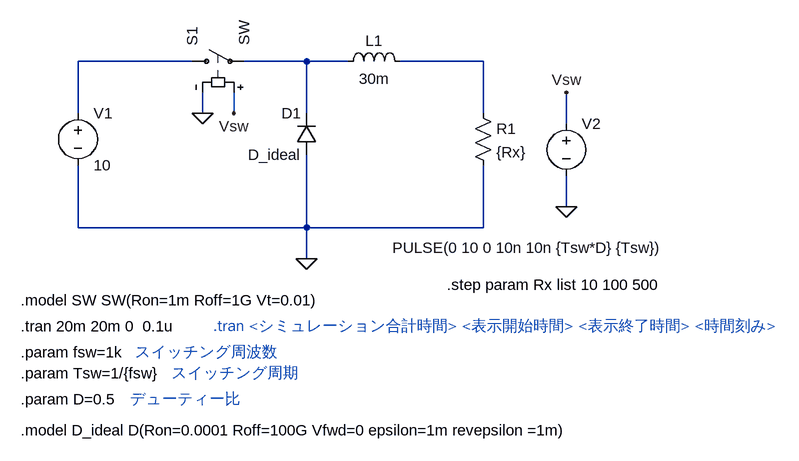
[diagram p0: schematic prof_03_back.asc]
prof_03_back.asc, the LTspice schematic file:
Version 4
SHEET 1 1108 680
WIRE 16 -16 -160 -16
WIRE 192 -16 96 -16
WIRE 256 -16 192 -16
WIRE 464 -16 336 -16
WIRE -160 64 -160 -16
WIRE 32 64 32 32
WIRE 80 64 80 32
WIRE 192 64 192 -16
WIRE 464 64 464 -16
WIRE 592 80 592 32
WIRE 592 208 592 160
WIRE -160 240 -160 144
WIRE 192 240 192 128
WIRE 192 240 -160 240
WIRE 464 240 464 144
WIRE 464 240 192 240
WIRE 192 288 192 240
FLAG 192 288 0
FLAG 592 208 0
FLAG 592 32 Vsw
FLAG 32 64 0
FLAG 80 64 Vsw
SYMBOL voltage -160 48 R0
SYMATTR InstName V1
SYMATTR Value 10
SYMBOL sw 0 -16 R270
SYMATTR InstName S1
SYMBOL ind 240 0 R270
WINDOW 0 32 56 VTop 2
WINDOW 3 5 56 VBottom 2
SYMATTR InstName L1
SYMATTR Value 30m
SYMBOL res 448 48 R0
SYMATTR InstName R1
SYMATTR Value {Rx}
SYMBOL diode 208 128 R180
WINDOW 0 24 64 Left 2
WINDOW 3 24 0 Left 2
SYMATTR InstName D1
SYMATTR Value D_ideal
SYMBOL voltage 592 64 R0
WINDOW 3 -268 207 Left 2
SYMATTR Value PULSE(0 10 0 10n 10n {Tsw*D} {Tsw})
SYMATTR InstName V2
TEXT -248 352 Left 2 !.model SW SW(Ron=1m Roff=1G Vt=0.01)
TEXT -248 392 Left 2 !.tran 20m 20m 0  0.1u
TEXT -248 432 Left 2 !.param fsw=1k
TEXT -248 464 Left 2 !.param Tsw=1/{fsw}
TEXT -248 504 Left 2 !.param D=0.5
TEXT -80 504 Left 2 ;デューティー比
TEXT -16 464 Left 2 ;スイッチング周期
TEXT -72 432 Left 2 ;スイッチング周波数
TEXT 48 392 Left 2 ;.tran <シミュレーション合計時間> <表示開始時間> <表示終了時間> <時間刻み>
TEXT -248 552 Left 2 !.model D_ideal D(Ron=0.0001 Roff=100G Vfwd=0 epsilon=1m revepsilon =1m)
TEXT 408 328 Left 2 !.step param Rx list 10 100 500

The netlist it stands for:
* prof_03_back.asc
V1 N001 0 10
S1 N001 N002 Vsw 0 SW
L1 N002 N003 30m
R1 N003 0 {Rx}
D1 0 N002 D_ideal
V2 Vsw 0 PULSE(0 10 0 10n 10n {Tsw*D} {Tsw})
.model D D
.lib standard.dio
.model SW SW(Ron=1m Roff=1G Vt=0.01)
.tran 20m 20m 0  0.1u
.param fsw=1k
.param Tsw=1/{fsw}
.param D=0.5
* デューティー比
* スイッチング周期
* スイッチング周波数
* .tran <シミュレーション合計時間> <表示開始時間> <表示終了時間> <時間刻み>
.model D_ideal D(Ron=0.0001 Roff=100G Vfwd=0 epsilon=1m revepsilon =1m)
.step param Rx list 10 100 500
.backanno
.end